# Altium schematic sheet Hammerhead - Master Schematic.SchDoc
size A; Author: Adam Vadala-Roth; DrawnBy: Adam Vadala-Roth; Engineer: Adam Vadala-Roth; DocumentNumber: 1
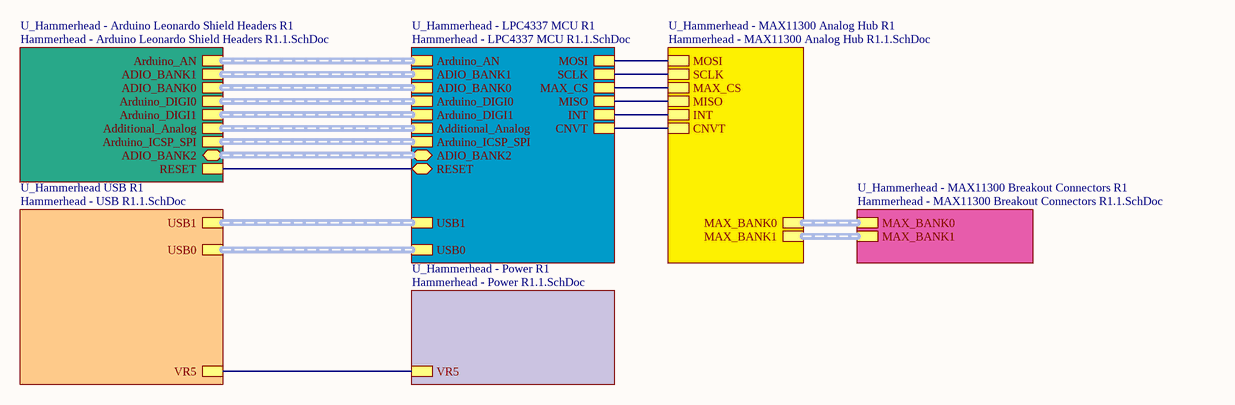
[diagram p0: Hammerhead - Master Schematic.SchDoc]

## Sub-sheets
U_Hammerhead - Arduino Leonardo Shield Headers R1 = Hammerhead - Arduino Leonardo Shield Headers R1.1.SchDoc: Arduino_AN (harness Arduino_AN), Arduino_DIGI0 (harness Arduino_DIGI0), Arduino_DIGI1 (harness Arduino_DIGI1), RESET, Additional_Analog (harness ADAN), ADIO_BANK1 (harness ADIO_BANK1), ADIO_BANK0 (harness ADIO_BANK0), Arduino_ICSP_SPI (harness Arduino_ICSP_SPI), ADIO_BANK2 (harness ADIO_BANK2)
U_Hammerhead - LPC4337 MCU R1 = Hammerhead - LPC4337 MCU R1.1.SchDoc: Arduino_AN (harness Arduino_AN), ADIO_BANK1 (harness ADIO_BANK1), ADIO_BANK0 (harness ADIO_BANK0), Arduino_DIGI0 (harness Arduino_DIGI0), Arduino_DIGI1 (harness Arduino_DIGI1), Additional_Analog (harness ADAN), USB1 (harness USB1), USB0 (harness USB0), Arduino_ICSP_SPI (harness Arduino_ICSP_SPI), MOSI, SCLK, MAX_CS, MISO, INT, CNVT, RESET, ADIO_BANK2 (harness ADIO_BANK2)
U_Hammerhead - MAX11300 Analog Hub R1 = Hammerhead - MAX11300 Analog Hub R1.1.SchDoc: MOSI, SCLK, MAX_CS, MISO, INT, CNVT, MAX_BANK0 (harness MAX_BANK0), MAX_BANK1 (harness MAX_BANK1)
U_Hammerhead - MAX11300 Breakout Connectors R1 = Hammerhead - MAX11300 Breakout Connectors R1.1.SchDoc: MAX_BANK0 (harness MAX_BANK0), MAX_BANK1 (harness MAX_BANK1)
U_Hammerhead - Power R1 = Hammerhead - Power R1.1.SchDoc: VR5
U_Hammerhead USB R1 = Hammerhead - USB R1.1.SchDoc: USB1 (harness USB1), USB0 (harness USB0), VR5

## Nets
(unnamed): sheet U_Hammerhead - Arduino Leonardo Shield Headers R1/RESET, sheet U_Hammerhead - LPC4337 MCU R1/RESET
(unnamed): sheet U_Hammerhead - LPC4337 MCU R1/MOSI, sheet U_Hammerhead - MAX11300 Analog Hub R1/MOSI
(unnamed): sheet U_Hammerhead - LPC4337 MCU R1/SCLK, sheet U_Hammerhead - MAX11300 Analog Hub R1/SCLK
(unnamed): sheet U_Hammerhead - LPC4337 MCU R1/MAX_CS, sheet U_Hammerhead - MAX11300 Analog Hub R1/MAX_CS
(unnamed): sheet U_Hammerhead - LPC4337 MCU R1/MISO, sheet U_Hammerhead - MAX11300 Analog Hub R1/MISO
(unnamed): sheet U_Hammerhead - LPC4337 MCU R1/INT, sheet U_Hammerhead - MAX11300 Analog Hub R1/INT
(unnamed): sheet U_Hammerhead - LPC4337 MCU R1/CNVT, sheet U_Hammerhead - MAX11300 Analog Hub R1/CNVT
(unnamed): sheet U_Hammerhead - Power R1/VR5, sheet U_Hammerhead USB R1/VR5

## Buses and harness runs
harness sheet U_Hammerhead - Arduino Leonardo Shield Headers R1/Additional_Analog = sheet U_Hammerhead - LPC4337 MCU R1/Additional_Analog
harness sheet U_Hammerhead - Arduino Leonardo Shield Headers R1/ADIO_BANK0 = sheet U_Hammerhead - LPC4337 MCU R1/ADIO_BANK0
harness sheet U_Hammerhead - Arduino Leonardo Shield Headers R1/ADIO_BANK1 = sheet U_Hammerhead - LPC4337 MCU R1/ADIO_BANK1
harness sheet U_Hammerhead - Arduino Leonardo Shield Headers R1/ADIO_BANK2 = sheet U_Hammerhead - LPC4337 MCU R1/ADIO_BANK2
harness sheet U_Hammerhead - Arduino Leonardo Shield Headers R1/Arduino_AN = sheet U_Hammerhead - LPC4337 MCU R1/Arduino_AN
harness sheet U_Hammerhead - Arduino Leonardo Shield Headers R1/Arduino_DIGI0 = sheet U_Hammerhead - LPC4337 MCU R1/Arduino_DIGI0
harness sheet U_Hammerhead - Arduino Leonardo Shield Headers R1/Arduino_DIGI1 = sheet U_Hammerhead - LPC4337 MCU R1/Arduino_DIGI1
harness sheet U_Hammerhead - Arduino Leonardo Shield Headers R1/Arduino_ICSP_SPI = sheet U_Hammerhead - LPC4337 MCU R1/Arduino_ICSP_SPI
harness sheet U_Hammerhead - LPC4337 MCU R1/USB0 = sheet U_Hammerhead USB R1/USB0
harness sheet U_Hammerhead - LPC4337 MCU R1/USB1 = sheet U_Hammerhead USB R1/USB1
harness sheet U_Hammerhead - MAX11300 Analog Hub R1/MAX_BANK0 = sheet U_Hammerhead - MAX11300 Breakout Connectors R1/MAX_BANK0
harness sheet U_Hammerhead - MAX11300 Analog Hub R1/MAX_BANK1 = sheet U_Hammerhead - MAX11300 Breakout Connectors R1/MAX_BANK1